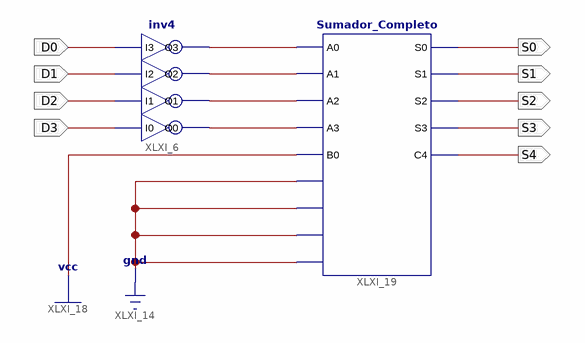
[diagram p0: schematic sheet 1]
// Xilinx ISE schematic Complemento_a2.sch (spartan6) as structural Verilog: 2 symbols, 9 ports
module Complemento_a2 (
  input  D0,
  input  D1,
  input  D3,
  input  D2,
  output S0,
  output S1,
  output S2,
  output S3,
  output S4
);

  wire A0, A1, A2, A3;

  inv4 XLXI_6 (.I0(D3), .I1(D2), .I2(D1), .I3(D0), .O0(A3), .O1(A2), .O2(A1), .O3(A0));
  Sumador_Completo XLXI_19 (
    .A0(A0), .A1(A1), .A2(A2), .A3(A3), .B0(1'b1), .B1(1'b0), .B2(1'b0), .B3(1'b0), .C0(1'b0), .C4(S4),
    .S0(S0), .S1(S1), .S2(S2), .S3(S3));
endmodule
